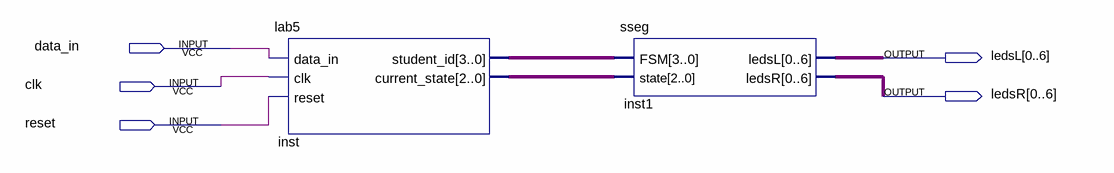
[diagram p0: schematic sheet]
// Quartus schematic lab5block.bdf as structural Verilog: 2 symbols, 5 pins
module lab5block (
  input  data_in,
  input  clk,
  input  reset,
  output [0:6] ledsL,
  output [0:6] ledsR
);

  wire [2:0] inst_current_state;
  wire [3:0] inst_student_id;

  lab5 inst (
    .data_in(data_in), .clk(clk), .reset(reset), .student_id(inst_student_id),
    .current_state(inst_current_state));
  sseg inst1 (.FSM(inst_student_id), .state(inst_current_state), .ledsL(ledsL), .ledsR(ledsR));
endmodule
